# EAGLE design Retro Audio Rev2.1 (EAGLE 7.7.0)
Assembly variants: Standard
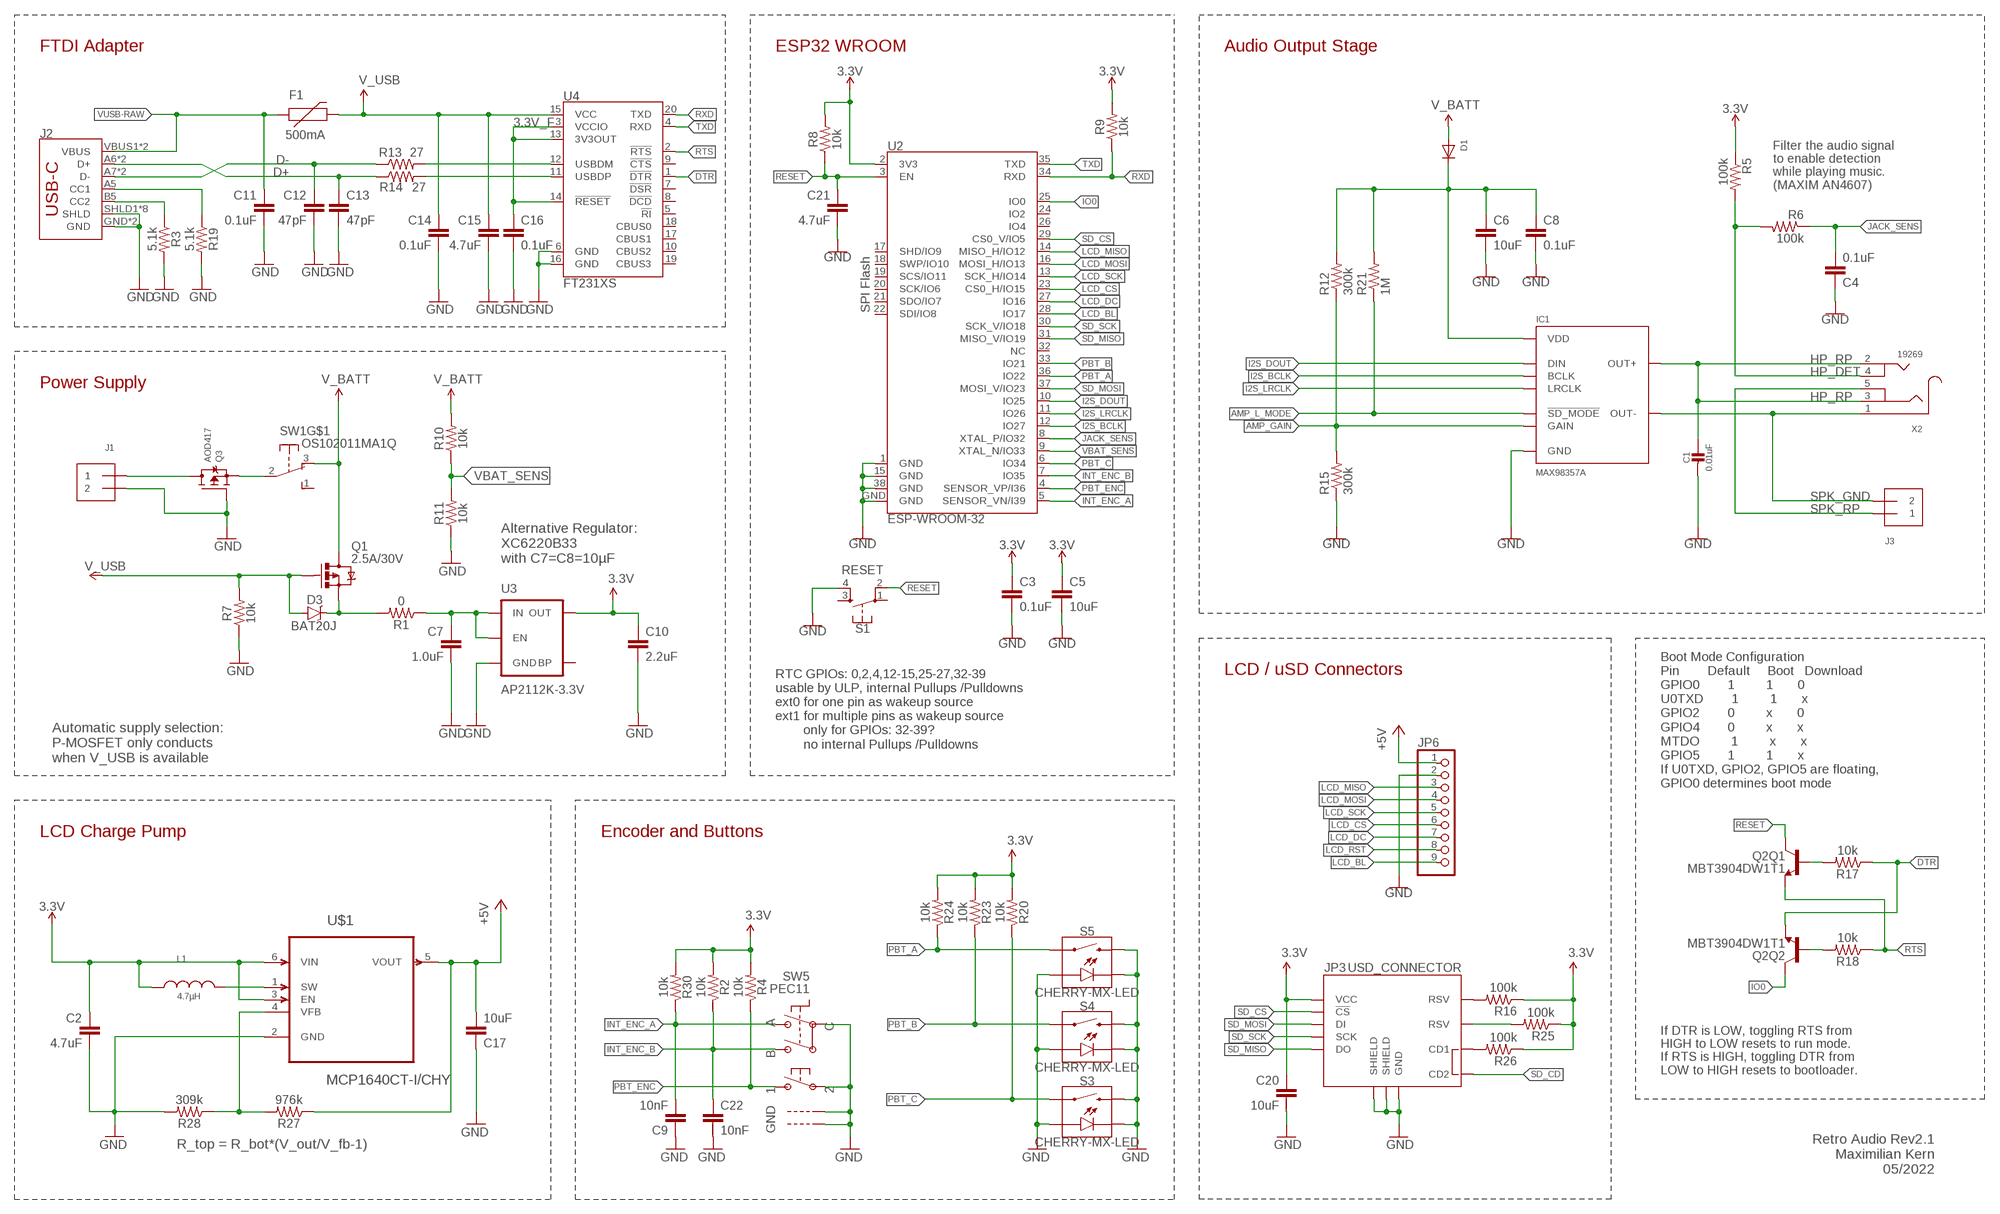
[diagram p0: schematic, sheet 1]

## Parts
C1  0.01uF  CAP_CERAMIC0603_NO  [0603-NO]  (not fitted in variant Standard)
C2  4.7uF  4.7UF-6.3V-10%(0603)0603  [0603-CAP]
C3  0.1uF  0.1UF-0603-25V-(+80/-20%)  [0603]
C4  0.1uF  0.1UF-0603-25V-(+80/-20%)  [0603]
C5  10uF  10UF-0603-6.3V-20%  [0603]
C6  10uF  10UF-0603-6.3V-20%  [0603]
C7  1.0uF  1.0UF-0805-25V-(+80/-20%)  [0805]
C8  0.1uF  0.1UF-0603-25V-(+80/-20%)  [0603]
C9  10nF  1.0UF-0805-25V-(+80/-20%)  [0805]
C10  2.2uF  1.0UF-0805-25V-(+80/-20%)  [0805]
C11  0.1uF  0.1UF-0603-25V-(+80/-20%)  [0603]
C12  47pF  47PF-0603-50V-5%  [0603]
C13  47pF  47PF-0603-50V-5%  [0603]
C14  0.1uF  0.1UF-0603-25V-(+80/-20%)  [0603]
C15  4.7uF  4.7UF-6.3V-10%(0603)0603  [0603-CAP]
C16  0.1uF  0.1UF-0603-25V-(+80/-20%)  [0603]
C17  10uF  47PF-0603-50V-5%  [0603]
C20  10uF  10UF-0603-6.3V-20%  [0603]
C21  4.7uF  4.7UF-6.3V-10%(0603)0603  [0603-CAP]
C22  10nF  1.0UF-0805-25V-(+80/-20%)  [0805]
D1  DIODE_SOD-123FL  [SOD-123FL]
D3  BAT20J  DIODE-SCHOTTKY-BAT20J  [SOD-323]
F1  500mA  PTCSMD  [PTC-1206]
IC1  MAX98357A  [TQFN-16]
J1  TERMBLOCK_1X2  [TERMBLOCK_1X2-3.5MM]
J2  USB_C16PIN  [USB-C-16P]
J3  TERMBLOCK_1X2  [TERMBLOCK_1X2-3.5MM]
JP3  USD_CONNECTOR  [MICRO-SD-SOCKET-PP]
JP6  PINHD-1X9  [1X09]
L1  4.7µH  WE-TPC_2813_744029004  [WE-TPC_2811/2813_OLD]
Q1  2.5A/30V  MOSFET-PCHANNELDMG2307L  [SOT23-3]
Q2  MBT3904DW1T1  [SC70-6]
Q3  AOD417  MOSFET-PTO252  [TO252]
R1  0  10KOHM-0603-1/10W-1%  [0603]
R2  10k  10KOHM-0603-1/10W-1%  [0603]
R3  5.1k  10KOHM-0603-1/10W-1%  [0603]
R4  10k  10KOHM-0603-1/10W-1%  [0603]
R5  100k  R-US_R0603  [R0603]
R6  100k  R-US_R0603  [R0603]
R7  10k  10KOHM-0603-1/10W-1%  [0603]
R8  10k  10KOHM-0603-1/10W-1%  [0603]
R9  10k  10KOHM-0603-1/10W-1%  [0603]
R10  10k  10KOHM-0603-1/10W-1%  [0603]
R11  10k  10KOHM-0603-1/10W-1%  [0603]
R12  300k  R-US_R0603  [R0603]  (not fitted in variant Standard)
R13  27  27OHM1/10W1%(0603)0603-RES  [0603]
R14  27  27OHM1/10W1%(0603)0603-RES  [0603]
R15  300k  R-US_R0603  [R0603]  (not fitted in variant Standard)
R16  100k  R-US_R0603  [R0603]
R17  10k  10KOHM-0603-1/10W-1%  [0603]
R18  10k  10KOHM-0603-1/10W-1%  [0603]
R19  5.1k  10KOHM-0603-1/10W-1%  [0603]
R20  10k  10KOHM-0603-1/10W-1%  [0603]
R21  1M  R-US_R0603  [R0603]
R23  10k  10KOHM-0603-1/10W-1%  [0603]
R24  10k  10KOHM-0603-1/10W-1%  [0603]
R25  100k  R-US_R0603  [R0603]
R26  100k  R-US_R0603  [R0603]
R27  976k  10KOHM-0603-1/10W-1%  [0603]
R28  309k  10KOHM-0603-1/10W-1%  [0603]
R30  10k  10KOHM-0603-1/10W-1%  [0603]
S1  RESET  MOMENTARY-SWITCH-SPST-2-SMD-4.6X2.8MM  [TACTILE_SWITCH_SMD_4.6X2.8MM]
S3  CHERRY-MX-LED  [CHERRY-MX-LED]
S4  CHERRY-MX-LED  [CHERRY-MX-LED]
S5  CHERRY-MX-LED  [CHERRY-MX-LED]
SW1  OS102011MA1Q  [OS102011MA1Q]
SW5  PEC11  ENCODER_PLUS_SWITCH_BOURNS_PEC11  [PEC11+SWITCH]
U2  ESP-WROOM-32  [ESP-WROOM-32]
U3  AP2112K-3.3V  V_REG_LDOSMD  [SOT23-5]
U4  FT231XS  [SSOP20_L]
U$1  MCP1640CT-I/CHY  [SOT95P270X145-6N]
X2  19269  AUDIO_3.5MMJACK  [4UCONN_19269]

## Nets
3.3V: C2.1 C3.1 C5.1 C10.1 C20.1 JP3.VCC L1.1 R2.2 R4.2 R5.1 R8.2 R9.2 R16.1 R20.2 R23.2 R24.2 R25.1 R26.1 R30.2 U2.2(3V3) U3.5(OUT) U$1.3(EN) U$1.6(VIN)
3.3V_F: C16.1 U4.3(VCCIO) U4.13(3V3OUT) U4.14(!RESET)
+5V: C17.2 JP6.1 R27.1 U$1.5(VOUT)
AMP_GAIN: IC1.P$2(GAIN) R12.1 R15.2
AMP_L_MODE: IC1.P$4(!SD_MODE) R21.1
B_VFB: R27.2 R28.1 U$1.4(VFB)
D+: C13.1 J2.A6(D+) J2.B6(D+) R14.1
D-: C12.1 J2.A7(D-) J2.B7(D-) R13.1
DTR: Q2.1(Q2:E) R17.1 U4.1(!DTR)
GND: C1.2 C2.2 C3.2 C4.1 C5.2 C6.2 C7.2 C8.2 C9.1 C10.2 C11.2 C12.2 C13.2 C14.2 C15.2 C16.2 C17.1 C20.2 C21.2 C22.2 IC1.P$3(GND) IC1.P$11(GND) IC1.P$15(GND) IC1.P$EP(GND) J1.2 J2.GND J2.GND2(GND) J2.SHLD1(SHLD) J2.SHLD2(SHLD) J2.SHLD3(SHLD) J2.SHLD4(SHLD) J2.SHLD5(SHLD) J2.SHLD6(SHLD) J2.SHLD7(SHLD) J2.SHLD8(SHLD) JP3.GND JP3.GND1(SHIELD) JP3.GND3(SHIELD) JP6.2 Q3.1(G) R3.2 R7.1 R11.1 R15.1 R19.2 R28.2 S1.4 S3.A S3.K(C) S3.S2 S4.A S4.K(C) S4.S2 S5.A S5.K(C) S5.S2 SW5.P$2 SW5.P$C SW5.P$GND1 SW5.P$GND2 U2.1(GND) U2.15(GND) U2.38(GND) U2.GND U3.2(GND) U4.6(GND) U4.16(GND) U$1.2(GND)
HP_DET: R5.2 R6.2 X2.4
HP_RP: C1.1 IC1.P$9(OUT+) X2.2 X2.3
I2S_BCLK: IC1.P$16(BCLK) U2.12(IO27)
I2S_DOUT: IC1.P$1(DIN) U2.10(IO25)
I2S_LRCLK: IC1.P$14(LRCLK) U2.11(IO26)
INT_ENC_A: C9.2 R30.1 SW5.P$A U2.5(SENSOR_VN/I39)
INT_ENC_B: C22.1 R2.1 SW5.P$B U2.7(IO35)
IO0: Q2.6(Q2:C) U2.25(IO0)
JACK_SENS: C4.2 R6.1 U2.8(XTAL_P/IO32)
LCD_BL: JP6.9 U2.28(IO17)
LCD_CS: JP6.6 U2.23(CS0_H/IO15)
LCD_DC: JP6.7 U2.27(IO16)
LCD_MISO: JP6.3 U2.14(MISO_H/IO12)
LCD_MOSI: JP6.4 U2.16(MOSI_H/IO13)
LCD_RST: JP6.8
LCD_SCK: JP6.5 U2.13(SCK_H/IO14)
N$2: J1.1 Q3.3(D)
N$3: C7.1 R1.1 U3.1(IN) U3.3(EN)
N$4: Q3.2(S) SW1.2(P)
N$5: D3.C Q1.2(S) R1.2
N$6: JP3.RSV1(RSV) R16.2
N$7: R13.2 U4.12(USBDM)
N$8: R14.2 U4.11(USBDP)
N$9: J2.A5(CC1) R19.1
N$10: Q2.5(Q1:B) R17.2
N$11: J2.B5(CC2) R3.1
N$12: Q2.2(Q2:B) R18.2
N$15: JP3.RSV2(RSV) R25.2
N$16: JP3.CD1 R26.2
N$17: L1.2 U$1.1(SW)
N$19: C6.1 C8.1 D1.C IC1.P$7(VDD) IC1.P$8(VDD) R12.2 R21.2
PBT_A: R24.1 S5.S1 U2.36(IO22)
PBT_B: R23.1 S4.S1 U2.33(IO21)
PBT_C: R20.1 S3.S1 U2.6(IO34)
PBT_ENC: R4.1 SW5.P$1 U2.4(SENSOR_VP/I36)
RESET: C21.1 Q2.3(Q1:C) R8.1 S1.2 U2.3(EN)
RTS: Q2.4(Q1:E) R18.1 U4.2(!RTS)
RXD: R9.1 U2.34(RXD) U4.20(TXD)
SD_CD: JP3.CD2
SD_CS: JP3.CS(!CS) U2.29(CS0_V/IO5)
SD_MISO: JP3.DO U2.31(MISO_V/IO19)
SD_MOSI: JP3.DI U2.37(MOSI_V/IO23)
SD_SCK: JP3.SCLK(SCK) U2.30(SCK_V/IO18)
SPK_GND: IC1.P$10(OUT-) J3.2 X2.1
SPK_RP: J3.1 X2.5
TXD: U2.35(TXD) U4.4(RXD)
V_BATT: D1.A Q1.3(D) R10.2 SW1.3(O)
V_USB: C14.1 C15.1 D3.A F1.2 Q1.1(G) R7.2 U4.15(VCC)
VBAT_SENS: R10.1 R11.2 U2.9(XTAL_N/IO33)
VUSB-RAW: C11.1 F1.1 J2.VBUS1(VBUS) J2.VBUS2(VBUS)
Unconnected: S1.1 S1.3 SW1.1(S) SW1.MT1(MT) SW1.MT2(MT) U2.17(SHD/IO9) U2.18(SWP/IO10) U2.19(SCS/IO11) U2.20(SCK/IO6) U2.21(SDO/IO7) U2.22(SDI/IO8) U2.24(IO2) U2.26(IO4) U2.32(NC) U3.4(BP) U4.5(!RI) U4.7(!DSR) U4.8(!DCD) U4.9(!CTS) U4.10(CBUS2) U4.17(CBUS1) U4.18(CBUS0) U4.19(CBUS3)

## Notes on the sheet
- FTDI Adapter | ESP32 WROOM | Audio Output Stage
- Filter the audio signal
  to enable detection
  while playing music.
  (MAXIM AN4607)
- SPI Flash
- Power Supply
- Alternative Regulator: 
  XC6220B33
  with C7=C8=10µF
- LCD / uSD Connectors
- Automatic supply selection:
  P-MOSFET only conducts
  when V_USB is available
- RTC GPIOs: 0,2,4,12-15,25-27,32-39
  usable by ULP, internal Pullups /Pulldowns
  ext0 for one pin as wakeup source
  ext1 for multiple pins as wakeup source
          only for GPIOs: 32-39?
          no internal Pullups /Pulldowns
- Boot Mode Configuration
  Pin        Default     Boot   Download
  GPIO0        1         1       0
  U0TXD        1         1       x
  GPIO2        0         x       0
  GPIO4        0         x       x
  MTDO         1         x       x
  GPIO5        1         1       x
  If U0TXD, GPIO2, GPIO5 are floating, 
  GPIO0 determines boot mode
- LCD Charge Pump | Encoder and Buttons
- If DTR is LOW, toggling RTS from 
  HIGH to LOW resets to run mode.
  If RTS is HIGH, toggling DTR from 
  LOW to HIGH resets to bootloader.
- R_top = R_bot*(V_out/V_fb-1)
- Retro Audio Rev2.1
  Maximilian Kern
  05/2022

## Library data of the parts
C1 = microbuilder:CAP_CERAMIC: Ceramic Capacitors For new designs, use the packages preceded by an '_' character since they are more reliable: The following footprints should be used on most boards: _0402 - Standard footprint for regular board layouts _0603 - Standard footprint for regular board layouts _0805 - Standard footprint for regular board layouts _1206 - Standard footprint for regular board layouts For extremely tight-pitch boards where space is at a premium, the following 'micro-pitch' footprints can be used (smaller pads, no silkscreen outline, etc.): _0402MP - Micro-pitch footprint for very dense/compact boards _0603MP - Micro-pitch footprint for very dense/compact boards _0805MP - Micro-pitch footprint for very dense/compact boards _1206MP - Micro-pitch footprint for very dense/compact boards
C2 C15 C21 = SparkFun-Capacitors:4.7UF-6.3V-10%(0603): CAP-08280; PROD_ID: CAP-08280
C3 C4 C8 C11 C14 C16 = SparkFun-Capacitors:0.1UF: 0.1µF ceramic capacitors A capacitor is a passive two-terminal electrical component used to store electrical energy temporarily in an electric field.; PROD_ID: CAP-00810
C5 C6 C20 = SparkFun-Capacitors:10UF: 10.0µF ceramic capacitors A capacitor is a passive two-terminal electrical component used to store electrical energy temporarily in an electric field.; PROD_ID: CAP-11015
C7 = SparkFun-Capacitors:1.0UF: 1µF ceramic capacitors A capacitor is a passive two-terminal electrical component used to store electrical energy temporarily in an electric field.; PROD_ID: CAP-11625
C9 C10 C22 = SparkFun-Capacitors:1.0UF: 1µF ceramic capacitors A capacitor is a passive two-terminal electrical component used to store electrical energy temporarily in an electric field.; PROD_ID: CAP-11625; VALUE: 1.0uF
C12 C13 = SparkFun-Capacitors:47PF: 47pF ceramic capacitors A capacitor is a passive two-terminal electrical component used to store electrical energy temporarily in an electric field.; PROD_ID: CAP-08913
C17 = SparkFun-Capacitors:47PF: 47pF ceramic capacitors A capacitor is a passive two-terminal electrical component used to store electrical energy temporarily in an electric field.; PROD_ID: CAP-08913; VALUE: 47pF
D1 = adafruit:DIODE: Diode SMADIODE - SMA Surface Mount Package 20V 1A Schottky Diode Digikey: 641-1014-6-ND DO-1N4148 - Through Hole Small Current Diode SOD-123 20V 1 A (.5mV Vf) Schottky Diode - Digikey: MBRX120TPMSCT-ND SOD-323 10V 570mA (.38mV Vf, 3ns) Schottky Diode - Digikey: ZLLS410CT-ND SOD-523 30V 30mA Schottky Diode (RB751S-40TE61) - Digikey: RB751S-40TE61CT-ND SOT23-R/W - SOT23 Package (R = Solder Paste/Reflow Ovens, W = Hand-Soldering) BAT54Film 40V 300mA - Digikey: 497-7162-1-ND
D3 = SparkFun-DiscreteSemi:DIODE-SCHOTTKY: Schottky diodes in SFE's production catalog BAT20J 1A 23V 0.62Vf RB751 120mA 40V 0.37Vf PMEG4005EJ 0.5A 40V 0.42Vf MBRA140 1A 40V 0.5Vf B340A 3A 40V SMA; PROD_ID: DIO-11623
F1 = SparkFun-PowerIC:PTC: Resettable Fuse PTC Resettable Fuse. Spark Fun Electronics SKU : COM-08357; PROD_ID: RES-11150
IC1 = SparkFun-IC-Amplifiers:MAX98357A: I2S DAC 3.2W (4-8ohm); PROD_ID: IC-14032
J1 J3 = microbuilder:TERMBLOCK_1X2: 3.5mm Terminal block http://www.ladyada.net/library/pcb/eaglelibrary.html
J2 = SparkFun-Connectors:USB_C: USB Type C 16Pin Connector Super Speed pins not available on the 16-pin purely SMD connector so this part is best for USB 2.0 implementations. D1 and D2 are tied together enabling D+/- no matter which way the cable is plugged into the connector. The two channel configuration pins (CC1/2) are exposed. These are normally connected to ground via 5.1k resistors but can be reconfigured for high current/high power applications.; PROD_ID: CONN-14122
JP3 = SparkFun-Connectors:USD_CONNECTOR: microSD Socket Push-push type µSD socket. Footprint production proven. Symbol has new and improved layout and naming accuracy. SparkFun Electronics SKU : PRT-00127. tDoc lines correctly indicate media card edge positions when inserting (unlocked, locked, depressed). NOTE: CD1 and CD2 are connected internally; PROD_ID: CONN-07820
JP6 = pinhead:PINHD-1X9: PIN HEADER
L1 = EMCComponents (rev19e):WE-TPC_2813: SMD Shielded Tiny Power Inductor Characteristics Extremely flat power inductor High current capability Magnetically shielded which results in a low leakage field Operating temperature: –40 °C to +125 °C Applications Portable power like PDA, digital camera, PCMCIA cards and displays DC/DC converter Embedded PC Mobile data gathering, telemetric <http://katalog.we-online.de/media/images/v2/WE-TPC_Gruppe_2.jpg> Details see: http://katalog.we-online.de/en/pbs/WE-TPC? Updated by Dan Xu 2014-07-11 2014 (C) Wurth Elektronik; WE-NUMBER: 744029004/4,7uH
Q1 = SparkFun-DiscreteSemi:MOSFET-PCHANNEL: Generic PMOSFET IRLML2244 - TRANS-11153 (SOT-23 -20V -4.3A) (1.Gate 2.Source 3.Drain) FQP27P06 - COM-10349 <http://www.sparkfun.com/products/10349> (TO-220 -60V -27A) (1.Gate 2.Source 3.Drain); PROD_ID: TRANS-11308
Q2 = esp32-thing-temp:MBT3904DW1T1: MBT3904DW1 Dual NPN Transistors The MBT3904W1 puts two general purpose 3904 NPN transistors in a single package. Datasheet <http://www.onsemi.com/pub_link/Collateral/MBT3904DW1T1-D.PDF>; PROD_ID: TRANS-13337
Q3 = microbuilder:MOSFET-P: P-Channel Mosfet LEGEND VDS: Voltage Drain-Source ID: Drain Current RDS(ON): Drain-Source On-State Resistance VGS(TH): Gate-Source Threshold Voltage CISS: Drain-Source Input Capacitance SOT-23 Name VDS ID RDS(ON) VGS(TH) CISS Order Number IRLML5103 30V 760mA 600 mOhm -- 75pF @ 25V Digikey: IRLML5103PBFCT-ND IRLML6401 12V 4.3A 50 mOhm 950mV @ 250µA 830pF @ 10V Digikey: IRLML6401PBFTR-ND NTR0202PL 20V 400mA 800 mOhm 2.3V @ 250uA 70pF @ 5V Digikey: NTR0202PLT1GOSTR-ND NTR4101PT1G 20V 1.8A 85 mOhm 1.2V @ 250uA 675pF @ 10V Digikey: NTR4101PT1GOSCT-ND DMP2004K 20V 600mA 900 mOhm 1V @ 250uA 175pF @ 16V Digikey: DMP2004KDICT-ND PMV65XP 20V 3.9A 76 mOhm 950mV @ 1mA 725pF @ 20V Digikey: 568-2358-2-ND TO-252 Name VDS ID RDS(ON) VGS(TH) CISS Order Number AOD417 30V 25A 34 mOhm 3V @ 250µA 920pF @ 15V Digikey: 785-1106-2-ND
R1 R3 R19 R27 R28 = SparkFun-Resistors:10KOHM: 10kΩ resistor A resistor is a passive two-terminal electrical component that implements electrical resistance as a circuit element. Resistors act to reduce current flow, and, at the same time, act to lower voltage levels within circuits. - Wikipedia; PROD_ID: RES-00824; VALUE: 10k
R2 R4 R7-R11 R17 R18 R20 R23 R24 R30 = SparkFun-Resistors:10KOHM: 10kΩ resistor A resistor is a passive two-terminal electrical component that implements electrical resistance as a circuit element. Resistors act to reduce current flow, and, at the same time, act to lower voltage levels within circuits. - Wikipedia; PROD_ID: RES-00824
R5 R6 R12 R15 R16 R21 R25 R26 = adafruit:R-US_: RESISTOR, American symbol
R13 R14 = SparkFun-Resistors:27OHM1/10W1%(0603): RES-09334; PROD_ID: RES-09334
S1 = SparkFun-Switches:MOMENTARY-SWITCH-SPST-2: Momentary Switch (Pushbutton) - SPST - Two Circuits Normally-open (NO) SPST momentary switches (buttons, pushbuttons). Schematic symbol includes two switch circuits. Variants SMD-4.6MMX2.8MM - 4.60mm x 2.80mm Tactile Momentary Button Switch - Used on SparkFun SAMD21 Mini Breakout <https://www.sparkfun.com/products/13664> SMD-5.2MM - Mini Pushbutton Switch - SMD <https://www.sparkfun.com/products/8720> - Used on Arduino Pro Mini <https://www.sparkfun.com/products/11114>; PROD_ID: SWCH-13065
S3-S5 = cherry-temp:CHERRY-MX-LED
SW1 = adafruit:OS102011MA1Q: OS10201MA1Q through-hole right angle switch http://www.ladyada.net/library/eagle
SW5 = adafruit_electromech:ENCODER_PLUS_SWITCH: Rotary Encoder with Built-In Switch PEC11 - 24 Step, PEC11-4215F-S24 - http://www.adafruit.com/products/377
U2 = SparkFun-RF:ESP-WROOM-32; PROD_ID: IC-13849
U3 = SparkFun-PowerIC:V_REG_LDO: Voltage Regulator LDO Standard 150mA LDO voltage regulator in SOT-23 layout. Micrel part MIC5205. BP (by-pass) pin is used to lower output noise with 470pF cap.; PROD_ID: VREG-12457
U4 = SparkFun-DigitalIC:FT231X: FTDI FT231X Full Speed USB to Full-handshake UART This USB2.0 Full Speed IC offers a compact bridge to full handshake UART interfaces. The device is a UART, capable of operating up to 3MBaud, with low power consumption (8mA). The FT231X includes the complete FT-X series feature set and enables USB to be added into a system design quickly and easily over a UART interface.; PROD_ID: IC-11524
U$1 = Microchip_By_element14_Batch_1:MCP1640CT-I/CHY: Synchronous Boost Regulator; MPN: MCP1640CT-I/CHY; OC_FARNELL: 1800208; OC_NEWARK: 73R3626; PACKAGE: SOT-6; SUPPLIER: Microchip
X2 = microbuilder:AUDIO_3.5MMJACK: 3.5MM Audio Jack These are normally connected as follows, from left-to right on the schematic symbol above: Tip: Left Audio Inner Ring: Right Audio Shell: Common/GND

## Board
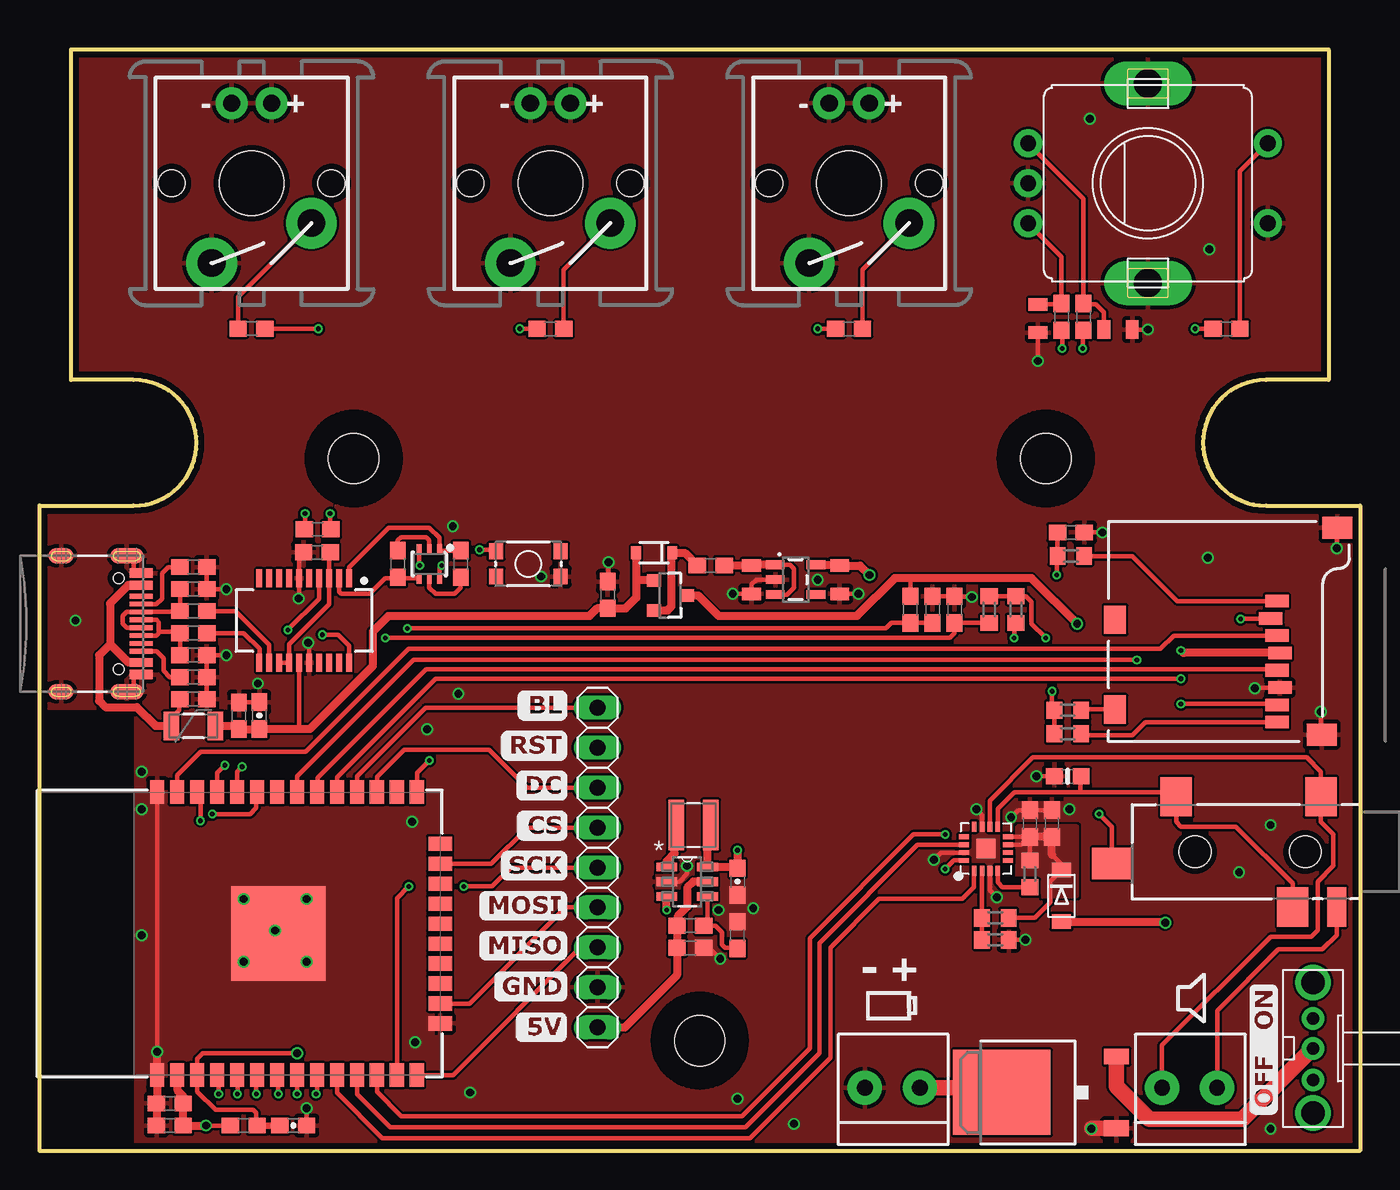
[diagram p1: board, top side]
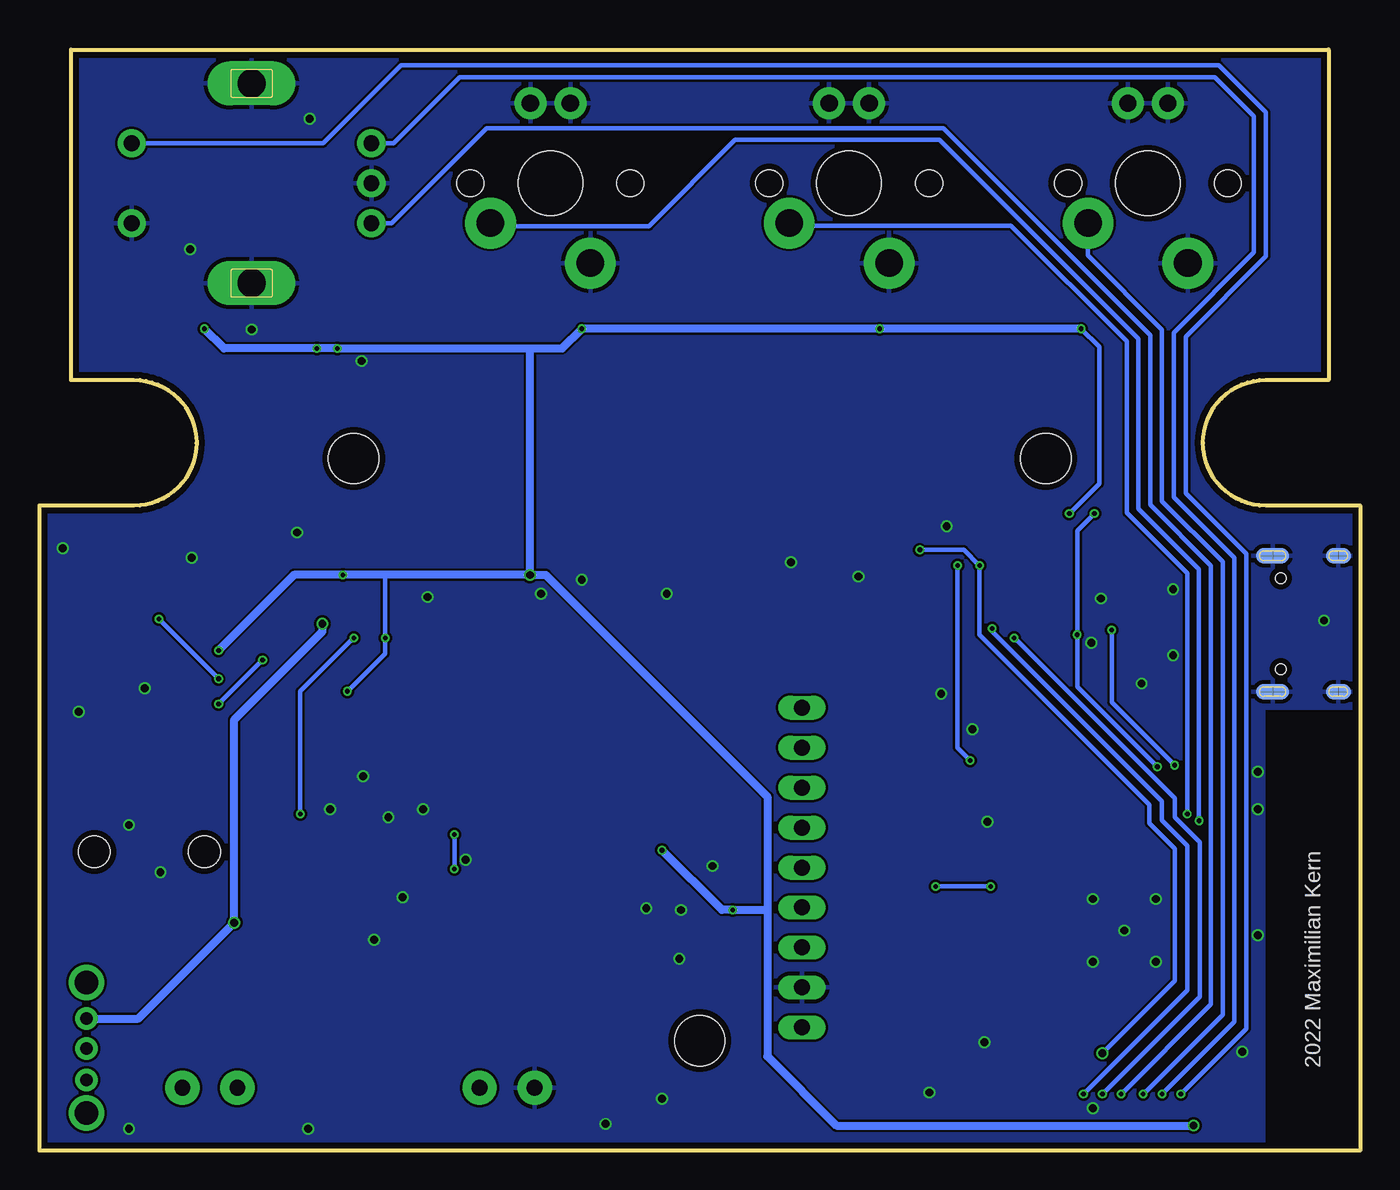
[diagram p2: board, bottom side, seen from below]

Size 84 x 70 mm. Coordinates in mm from the lower left corner, seen from the top.
Outline: 82,70 2,70 2,49 6,49 arc-180 6,41 0,41 0,0 84,0 84,41 78,41 arc-180 78,49 82,49 82,70
Copper layers (1*16): Top 0.035559375mm / dielectric 1.6mm / Bottom 0.035559375mm
Design rules "oshpark-2layer *": minimum track width 6mil, minimum drill 10mil, track to track 6mil, track to pad 6mil, pad to pad 6mil, via to via 6mil, smd to smd 6mil, copper to edge 15mil, drill to drill 6mil, minimum pad ring 5mil, minimum via ring 5mil, stop-mask expansion 2.5mil, vias tented up to drill 43mil, thermal gap 10mil
Holes 3.2 mm at 20,44 64,44 42,7
tKeepout: area 1,48 to 3,70; area 81,48 to 83,70; area 1,48 to 83,50
tRestrict: area 0,0 to 6,28
bRestrict: area 0,0 to 6,28

### Footprints (pad centres in the part's own frame; a part is rotated, then mirrored left to right if it is on the bottom)
0603-NO = smd 1.075 x 1: 1 -0.85,0; 2 0.85,0
0603-CAP = smd 1.1 x 1: 1 -0.85,0; 2 0.85,0
0603 = smd 1.1 x 1: 1 -0.85,0; 2 0.85,0
0805 = smd 0.8 x 1.2: 1 -0.9,0; 2 0.9,0
SOD-123FL = smd 0.91 x 1.22: A 1.637,0; C -1.637,0
SOD-323 = smd 0.63 x 0.83: A 1.15,0; C -1.15,0
PTC-1206 = smd 1 x 1.8: 1 -1.4,0; 2 1.4,0
TQFN-16 = smd 0.3 x 0.65: P$1 -0.75,-1.4; P$2 -0.25,-1.4; P$3 0.25,-1.4; P$4 0.75,-1.4; P$9 0.75,1.4; P$10 0.25,1.4; P$11 -0.25,1.4; P$12 -0.75,1.4 | smd 0.65 x 0.3: P$5 1.4,-0.75; P$6 1.4,-0.25; P$7 1.4,0.25; P$8 1.4,0.75; P$13 -1.4,0.75; P$14 -1.4,0.25; P$15 -1.4,-0.25; P$16 -1.4,-0.75 | smd 1.23 x 1.23: P$EP 0,0
TERMBLOCK_1X2-3.5MM = drill 1 pad 2.184: 1 1.8,0; 2 -1.7,0
USB-C-16P = smd 0.3 x 1.45: A5 -1.25,0; A6 -0.25,0; A7 0.25,0; A8 1.25,0; B5 1.75,0; B6 0.75,0; B7 -0.75,0; B8 -1.75,0 | smd 0.6 x 1.45: GND -3.225,0; GND2 3.225,0 | smd 1 x 2.1: SHLD1 -4.32,-0.915; SHLD2 4.32,-0.915 | smd 1 x 2.1 bottom: SHLD3 -4.32,-0.915; SHLD4 4.32,-0.915 | smd 1 x 1.6: SHLD5 -4.32,-5.095; SHLD8 4.32,-5.095 | smd 1 x 1.6 bottom: SHLD6 -4.32,-5.095; SHLD7 4.32,-5.095 | smd 0.55 x 1.45: VBUS1 -2.45,0; VBUS2 2.45,0 | hole 0.65: -2.89,-1.445; 2.89,-1.445
MICRO-SD-SOCKET-PP = smd 1.8 x 1.4: CD1 -2.05,0.4; CD2 -7.75,0.4 | smd 0.8 x 1.5: CS -7.84,10.3; DI -6.74,10.7; DO -2.34,10.7; GND -3.44,10.9; RSV1 -8.94,10.7; RSV2 -1.24,10.7; SCLK -4.54,10.7; VCC -5.64,10.9 | smd 1.4 x 1.9: GND1 -13.6,14.55; GND3 -0.45,13.55
1X09 = drill 1.016 long: 1 -10.16,0; 2 -7.62,0; 3 -5.08,0; 4 -2.54,0; 5 0,0; 6 2.54,0; 7 5.08,0; 8 7.62,0; 9 10.16,0
WE-TPC_2811/2813_OLD = smd 1 x 3.2: 1 -1.1,0; 2 1.1,0
SOT23-3 = smd 0.8 x 0.9: 1 -0.95,-1; 2 0.95,-1; 3 0,1.1
SC70-6 = smd 0.3 x 0.66: 1 -0.65,-0.92; 2 0,-0.92; 3 0.65,-0.92; 4 0.65,0.92; 5 0,0.92; 6 -0.65,0.92
TO252 = smd 1 x 1.6: 1 -2.28,-4.8; 2 2.28,-4.8 | smd 5.4 x 6.2: 3 0,2.5
R0603 = smd 1 x 1.1: 1 -0.85,0; 2 0.85,0
TACTILE_SWITCH_SMD_4.6X2.8MM = smd 0.9 x 1: 1 -2.05,-0.8; 2 2.05,-0.8; 3 2.05,0.8; 4 -2.05,0.8
CHERRY-MX-LED = drill 1.092 pad 2.032: A -1.27,-5.08; K 1.27,-5.08 | drill 1.753 pad 3.226: S1 -3.81,2.54; S2 2.54,5.08 | hole 4.089: 0,0 | hole 1.707: -5.08,0; 5.08,0
OS102011MA1Q = drill 0.8 pad 1.422: 1 -2,0; 2 0,0; 3 1.9,0 | drill 1.5 pad 2.184: MT1 -4.1,0; MT2 4.2,0
PEC11+SWITCH = drill 1 pad 1.8: P$1 -2.54,7.62; P$2 2.54,7.62; P$A -2.54,-7.62; P$B 2.54,-7.62; P$C 0,-7.62 | drill 1.8 pad 2.8 long: P$GND1 -6.35,0; P$GND2 6.35,0
ESP-WROOM-32 = smd 0.9 x 1.5: 1 7.7,9; 2 6.43,9; 3 5.16,9; 4 3.89,9; 5 2.62,9; 6 1.35,9; 7 0.08,9; 8 -1.19,9; 9 -2.46,9; 10 -3.73,9; 11 -5,9; 12 -6.27,9; 13 -7.54,9; 14 -8.81,9; 25 -8.81,-9; 26 -7.54,-9; 27 -6.27,-9; 28 -5,-9; 29 -3.73,-9; 30 -2.46,-9; 31 -1.19,-9; 32 0.08,-9; 33 1.35,-9; 34 2.62,-9; 35 3.89,-9; 36 5.16,-9; 37 6.43,-9; 38 7.7,-9 | smd 1.5 x 0.9: 15 -10.3,5.715; 16 -10.3,4.445; 17 -10.3,3.175; 18 -10.3,1.905; 19 -10.3,0.635; 20 -10.3,-0.635; 21 -10.3,-1.905; 22 -10.3,-3.175; 23 -10.3,-4.445; 24 -10.3,-5.715 | smd 6 x 6: GND 0,0
SOT23-5 = smd 0.55 x 1.2: 1 -0.95,-1.3; 2 0,-1.3; 3 0.95,-1.3; 4 0.95,1.3; 5 -0.95,1.3
SSOP20_L = smd 0.381 x 1.143: 1 -2.857,-2.68; 2 -2.223,-2.68; 3 -1.587,-2.68; 4 -0.953,-2.68; 5 -0.318,-2.68; 6 0.318,-2.68; 7 0.953,-2.68; 8 1.587,-2.68; 9 2.223,-2.68; 10 2.857,-2.68; 11 2.857,2.68; 12 2.223,2.68; 13 1.587,2.68; 14 0.953,2.68; 15 0.318,2.68; 16 -0.318,2.68; 17 -0.953,2.68; 18 -1.587,2.68; 19 -2.223,2.68; 20 -2.857,2.68
SOT95P270X145-6N = smd 1.321 x 0.559: 1 -1.295,0.94; 2 -1.295,0; 3 -1.295,-0.94; 4 1.295,-0.94; 5 1.295,0; 6 1.295,0.94
4UCONN_19269 = smd 2 x 2.5: 1 2.5,-3.5; 2 11.7,-3.5; 3 4.3,3.5 | smd 2.5 x 2: 4 15.8,0.75 | smd 1.2 x 2.5: 5 1.5,3.5 | hole 2: 3.5,0; 10.5,0

### Placement (x,y rotation side)
C1  65.4,23.8 180 top  (not fitted)
C2  44.4,17.1 270 top
C3  8.3,3 180 top
C4  58.2,34.4 270 top
C5  8.3,1.6 180 top
C6  63,20.8 90 top
C7  45.3,36.3 270 top
C8  64.4,20.8 90 top
C9  68.6,52.2 180 top
C10  50.9,36.3 270 top
C11  9.8,28.7 0 top
C12  9.8,35.7 0 top
C13  9.8,31.5 0 top
C14  12.7,27.65 90 top
C15  14.01,27.66 90 top
C16  17.66,38.04 180 top
C17  41.4,12.9 180 top
C20  65.6,39.3 0 top
C21  16.15,1.6 0 top
C22  63.5,52.9 270 top
D1  65,16.2 270 top
D3  39.1,38 180 top
F1  9.8,27 0 top
IC1  60.2,19.2 0 top
J1  54.2,4 0 top
J2  6.49,33.49 270 top
J3  73.1,4 0 top
JP3  68,26 270 top
JP6  35.5,18 90 top
L1  41.6,20.7 180 top
Q1  40.1,35.3 270 top
Q2  24.8,37.3 180 top
Q3  63.7,3.7 90 top
R1  42.7,37.2 180 top
R2  65,53 270 top
R3  9.8,30.1 0 top
R4  75.5,52.25 180 top
R5  62.1,34.4 90 top
R6  60.4,34.4 90 top
R7  36.15,35.33 270 top
R8  13,1.6 180 top
R9  17.7,39.5 0 top
R10  55.4,34.4 90 top
R11  56.8,34.4 270 top
R12  60.8,14.8 0 top  (not fitted)
R13  9.8,34.3 0 top
R14  9.8,32.9 0 top
R15  60.8,13.4 180 top  (not fitted)
R16  65.6,37.8 0 top
R17  26.8,37.3 270 top
R18  22.8,37.3 90 top
R19  9.8,37.1 0 top
R20  13.5,52.25 0 top
R21  63,17.6 90 top
R23  32.5,52.25 180 top
R24  51.5,52.25 180 top
R25  65.4,26.5 0 top
R26  65.4,28 0 top
R27  41.4,14.3 0 top
R28  44.4,13.7 90 top
R30  66.4,53 270 top
S1  31.1,37.3 180 top
S3  13.5,61.5 180 top
S4  32.5,61.5 180 top
S5  51.5,61.5 180 top
SW1  81,6.5 90 top
SW5  70.5,61.5 270 top
U2  15.2,13.8 180 top
U3  48.1,36.3 270 top
U4  16.84,33.7 180 top
U$1  41.2,17.1 0 top
X2  84,19 180 top

### Tracks (layer width: path | path; a pad name or v marks a point on that pad's centre or on a via)
3.3V  (via drill 0.3, 0.5)
  Top 0.3: R25.1 R26.1 64.4,28.15 v64.4,29.2 | R4.2 v73.5,52.25 | R20.2 v17.75,52.25 | R24.2 v49.5,52.25 | R23.2 v30.55,52.25 | 9.35,1.65 9.4,1.6 | 42.49,20.5 L1.1 | R8.2 v10.6,1.6 | 50.85,37.25 C10.1 | 49.5,37.35 U3.5 | v65.05,51 65.05,52.1 R2.2 | v66.35,51 66.35,52.1 R30.2 | C20.1 R16.1 64.7,37.75 v64.7,36.6 | v18.5,40.5 18.5,39.55 R9.2 | v62,32.6 62,33.45 R5.1
  Top 0.5: JP3.VCC 72.76,31.64 v72.6,31.8 | 9.4,1.6 v10.6,1.6 | U3.5 50.85,37.25 | 42.49,20.5 U$1.6 44.31,18.04 C2.1 v44.4,19.1 | C10.1 52.2,37.2 v52.8,36.6 | U2.2 8.8,4.77 8.8,3.8 9.15,3.45 C3.1 C5.1 9.2,1.65 9.35,1.65 | v39.9,15.3 U$1.3
  Bottom 0.3: 62,36.6 v62,32.6 62,31.6 v64.4,29.2 | 52.8,50.8 53,51 | 37.8,15.3 37.7,15.2 | v17.75,52.25 16.6,51.1 16.6,42.4 v18.5,40.5
  Bottom 0.5: v17.75,52.25 v30.55,52.25 v49.5,52.25 50.75,51 53,51 v65.05,51 v66.35,51 72.25,51 v73.5,52.25 | v72.6,31.8 67.8,36.6 v64.7,36.6 62,36.6 v52.8,36.6 | v44.4,19.1 40.6,15.3 v39.9,15.3 37.8,15.3 | v52.8,36.6 51.8,36.6 37.7,22.5 37.7,15.2 37.7,6 33.3,1.6 v10.6,1.6 | v52.8,36.6 52.8,50.8
3.3V_F
  Top 0.3: U4.13 U4.14 15.9,32.2 18.43,34.73 U4.3 18.43,37.96 C16.1
+5V
  Top 0.3: 40.6,14.35 R27.1
  Top 0.5: R27.1 C17.2 40.55,11.15 37.24,7.84 JP6.1 | U$1.5 41.6,17.1 41.2,16.7 41.2,15.5 40.6,14.9 40.6,14.35
AMP_GAIN
  Top 0.3: R15.2 R12.1 IC1.P$2
AMP_L_MODE
  Top 0.3: R21.1 61.25,16.75 60.95,17.05 IC1.P$4
B_VFB
  Top 0.3: U$1.4 42.49,14.54 R27.2 43,14.3 43.4,13.9 43.4,13.1 43.6,12.9 44.35,12.9 R28.1
D+
  Top 0.3: J2.B6 7.45,32.74 7.6,32.9 7.6,33 | 7.6,33 7.6,33.6 7.46,33.74 J2.A6 | 7.6,33 8.85,33 R14.1 C13.1
D-
  Top 0.3: J2.A7 5.55,33.24 5.3,33.5 5.3,34 5.54,34.24 J2.B7 8.89,34.24 R13.1 C12.1
DTR
  Top 0.3: R17.1 25.52,38.15 Q2.1 25.45,38.95 24.8,39.6 22.2,39.6 19.7,37.1 U4.1
GND  (via drill 0.5)
  Top 0.3: C11.2 R3.2 C13.2 11.6,31.5 | C8.2 C6.2 62.25,21.65 v61.8,21.2 | U2.38 v7.5,6.3 | C14.2 13.99,28.5 C15.2 | C16.2 16.53,37.76 U4.6 16.53,35.13 v16.5,35.1 | R19.2 C12.2 11.6,35.7 | 6,30.27 6,29.25 5.57,29.25 J2.SHLD4 | J2.GND 6,36.72 6,37.81 J2.SHLD1 | 7.5,3.05 C3.2 | C21.2 v17,2.7 | 66.92,1.42 v66.9,1.4 | 44.45,16.2 C2.2 | U$1.2 40.7,17.1 41.2,17.6 v41.2,18.1 | v82.5,38.3 82.5,39.55 JP3.GND1 | v81.5,27.9 81.5,26.5 JP3.GND3 | JP3.GND 77.34,29.44 v77.3,29.4 | C20.2 v67.6,39.3 | C9.1 v70.5,52.2 | C22.2 v63.5,50.2 | v36.2,37.4 36.2,36.23 R7.1 | v44.1,35.4 C7.2 45.3,36 45.6,36.3 U3.2 | R11.1 C4.1 58.25,35.2 v59.3,35.2 | U4.16 17.16,32.24 v17.1,32.3 | IC1.P$3 60.45,16.55 v60.9,16.1 | IC1.P$11 59.95,21.35 v59.6,21.7 | v62.7,13.4 R15.1 | IC1.P$15 57.35,18.95 v56.9,18.5 | C1.2 v63.4,23.8 | C17.1 42.6,12.9 v43.3,12.2 | C10.2 v52.1,35.4
  Top 0.5: C3.2 C5.2 | v7.5,6.3 U2.1 7.5,3.05
  Top 1: Q3.1 66.92,1.42
  other vias: 13,16 17,16 17,12 13,12 15,14 6.5,24.1 6.5,21.7 49.5,36.3 23.7,20.9 23.9,6.9 65.5,21.7 43.2,15.3 31.9,36.5 13.9,29.7 11.9,35.7 11.9,31.5 26.3,39.7 6.5,13.7 45.4,15.4 27.4,3.7 48,1.7 44.4,3.3 78.3,1.4 74.4,57.3 66.8,65.6 26.65,29.05 24.65,26.8 2.3,33.7 78.3,20.7 76.3,17.7 74.3,37.7
  pour Bottom: -1,71 87,71 87,-1 -1,-1
  pour Top (no thermals): 6,22.5 6,5 25,5 25,22.5
  pour Top (rank 2, no thermals): 66.1,20.8 66.1,22.1 59.2,22.1 59.2,15.6 62.1,15.6 62.1,20.8
  pour Top (no thermals): 39.3,18.5 45.6,18.5 45.6,11.9 39.3,11.9
  pour Top (rank 3): -1,71 87,71 87,-1 -1,-1
HP_DET  (via drill 0.3)
  Top 0.3: X2.4 68.2,20.6 v67.4,21.4 | R6.2 R5.2 62.75,35.25 63.1,34.9 63.1,33.5 v64,32.6
  Bottom 0.3: v67.4,21.4 67.4,29.2 v64,32.6
HP_RP
  Top 0.3: 72.2,22.4 X2.2 | IC1.P$9 60.95,21.75 62,22.8 66.2,22.8 | 66.2,22.8 72,22.8 X2.2 | 66.2,22.8 66.2,23.75 C1.1 | X2.3 79.7,17 76.1,20.6 72.6,20.6 72.3,20.9 X2.2
I2S_BCLK  (via drill 0.3)
  Top 0.3: U2.12 21.47,3.73 23,2.2 44.7,2.2 49,6.5 49,13.5 55.6,20.1 v57.6,20.1 | IC1.P$16 58.15,18.45 v57.6,17.9
  Bottom 0.3: v57.6,17.9 v57.6,20.1
I2S_DOUT
  Top 0.3: U2.10 18.93,3.67 21.8,0.8 45.2,0.8 50.3,5.9 50.3,12.9 53.4,16 58.7,16 59.45,16.75 IC1.P$1
I2S_LRCLK
  Top 0.3: U2.11 20.2,3.6 22.3,1.5 44.9,1.5 49.6,6.2 49.6,13.2 55.85,19.45 IC1.P$14
INT_ENC_A  (via drill 0.3)
  Top 0.3: v12.6,3.6 12.6,4.78 U2.5 | SW5.P$A 66.4,60.52 R30.1 66.35,53.8 67.2,53.8 67.7,53.3 C9.2
  Bottom 0.3: v12.6,3.6 8,8.2 8,37.7 11.85,41.55 11.85,52 6.75,57.1 6.75,65.75 9.25,68.25 57.27,68.25 61.48,64.04 SW5.P$A
INT_ENC_B  (via drill 0.3)
  Top 0.3: v15.2,3.6 15.2,4.72 U2.7 | SW5.P$B 65,56.84 R2.1 64.95,53.8 C22.1
  Bottom 0.3: SW5.P$B 61.59,58.96 55.55,65 26.5,65 13.35,51.85 13.35,41.05 9.5,37.2 9.5,9.3 v15.2,3.6
IO0  (via drill 0.3)
  Top 0.3: v24.8,24.8 24.01,24.01 U2.25 24.06,22.85 24.06,22.95 | Q2.6 25.45,37.05 v25.6,37.2
  Bottom 0.3: v25.6,37.2 25.6,25.6 v24.8,24.8
JACK_SENS  (via drill 0.3)
  Top 0.3: U2.8 v16.39,3.61 v16.4,3.6 | v22,32.6 57.9,32.6 58.2,32.9 C4.2 R6.1
  Bottom 0.3: v16.4,3.6 10.2,9.8 10.2,19.6 11.8,21.2 11.8,22.4 v22,32.6
LCD_BL
  Top 0.3: JP6.9 24.56,28.16 20.2,23.8 U2.28
LCD_CS
  Top 0.3: U2.23 28.75,18.25 31.04,20.54 JP6.6
LCD_DC
  Top 0.3: U2.27 21.47,23.77 23.2,25.5 28.6,25.5 31.02,23.08 JP6.7
LCD_MISO
  Top 0.3: JP6.3 34.42,12.92 26.3,4.8 U2.14
LCD_MOSI
  Top 0.3: U2.16 27.36,9.36 33.46,15.46 JP6.4
LCD_SCK  (via drill 0.3)
  Top 0.3: U2.13 22.74,16.04 v23.5,16.8 | v27,16.8 28.8,16.8 30,18 JP6.5
  Bottom 0.3: v23.5,16.8 v27,16.8
N$2
  Top 1: J1.1 60.9,4 Q3.3
N$3
  Top 0.3: 45.35,37.25 C7.1 | U3.1 47.75,37.25 48,37 48,35.8 47.55,35.35 U3.3
  Top 0.5: U3.1 45.35,37.25 | C7.1 R1.1
N$4
  Top 1: Q3.2 68.5,4.1 70.6,2 76.5,2 SW1.2
N$5
  Top 0.5: Q1.2 39.95,34.35 40.2,34.6 40.2,37.95 D3.C 41.05,38 R1.2
N$6
  Top 0.3: JP3.RSV1 72.36,34.94 69.5,37.8 R16.2
N$7
  Top 0.3: U4.12 14.62,32.18 12.5,34.3 R13.2
N$8
  Top 0.3: R14.2 13,32.9 14,31.9 U4.11
N$9
  Top 0.3: J2.A5 7.45,34.74 7.8,35.1 7.8,36.7 8.2,37.1 R19.1
N$10
  Top 0.3: R17.2 26.8,35.8 26.4,35.4 25.2,35.4 24.8,35.8 Q2.5
N$11
  Top 0.3: J2.B5 7.46,31.75 7.9,31.3 7.9,30.5 8.3,30.1 R3.1
N$12
  Top 0.3: Q2.2 24.8,38.8 24.6,39 23,39 22.8,38.8 R18.2
N$15
  Top 0.3: JP3.RSV2 70.34,27.24 69.5,26.4 66.35,26.4 R25.2
N$16
  Top 0.3: JP3.CD1 66.3,28.05 R26.2
N$17
  Top 0.3: 40.4,20.6 L1.2
  Top 0.5: U$1.1 39.91,18.41 40.4,18.9 40.4,20.6
N$18
  cutout Top: 45,7 arc-90 42,4 arc-90 39,7 arc-90 42,10 arc-90
  cutout Top: 67,44 arc-90 64,41 arc-90 61,44 arc-90 64,47 arc-90
  cutout Top: 23,44 arc-90 20,41 arc-90 17,44 arc-90 20,47 arc-90
N$19
  Top 0.3: IC1.P$8 C6.1 R21.2 | IC1.P$7 62.45,19.45 63,20 | 64.4,18.8 65,18.2 D1.C 64.3,17.14 64.3,15.8 63.3,14.8 R12.2
  Top 0.5: C6.1 C8.1 64.4,18.8
  pour Top (no thermals): 62.3,16.3 65.9,16.3 65.9,20.5 62.3,20.5
PBT_A  (via drill 0.3)
  Top 0.3: R24.1 52.35,56 S5.S1 | v10.25,20.98 10.25,22.59 U2.36
  Bottom 0.3: v10.25,20.98 10.25,36.95 14.1,40.8 14.1,51.6 26.75,64.25 39.75,64.25 45.24,58.76 55.11,58.76 S5.S1
PBT_B  (via drill 0.3)
  Top 0.3: R23.1 33.35,56 S4.S1 | v11,21.4 13.4,21.4 13.8,21.8 13.8,22.75 U2.33
  Bottom 0.3: v11,21.4 11,36.7 14.85,40.55 14.85,51.45 22.2,58.8 36.15,58.8 S4.S1
PBT_C  (via drill 0.3)
  Top 0.3: R20.1 12.65,54.3 S3.S1 | v13.8,3.6 13.8,4.75 U2.6
  Bottom 0.3: v13.8,3.6 8.75,8.65 8.75,37.45 12.6,41.3 12.6,52.2 17.31,56.91 S3.S1
PBT_ENC  (via drill 0.3)
  Top 0.3: R4.1 76.35,62.27 SW5.P$1 | v11.4,3.6 11.4,4.71 U2.4
  Bottom 0.3: SW5.P$1 65.96,64.04 61,69 9,69 6,66 6,56.85 11.1,51.75 11.1,41.8 7.25,37.95 7.25,7.75 v11.4,3.6
RESET  (via drill 0.3, 0.5)
  Top 0.3: v16.4,6.2 10.4,6.2 10.04,5.84 U2.3 10.04,3.76 11.2,2.6 13.6,2.6 13.8,2.4 13.8,1.6 R8.1 | Q2.3 24.15,37.15 v24.2,37.2 | v28,38.2 28.95,38.2 S1.2
  Top 0.406: C21.1 R8.1 | R8.1
  Bottom 0.3: v16.4,6.2 11.8,10.8 11.8,19.2 13.4,20.8 13.4,22 24.2,32.8 v24.2,37.2 25.2,38.2 v28,38.2
RTS
  Top 0.3: Q2.4 22.87,36.38 R18.1 22.75,36.4 22,36.4 21,35.4 19.2,35.4 19.07,35.53 U4.2
RXD  (via drill 0.3)
  Top 0.3: U4.20 19.7,32.1 19,32.8 v18,32.8 | U2.34 12.58,24.08 v12.9,24.4 | v16.9,40.5 16.9,39.55 R9.1
  Bottom 0.3: v12.9,24.4 18,29.5 v18,32.8 18,39.4 v16.9,40.5
SD_CS  (via drill 0.3)
  Top 0.3: U2.29 18.93,23.73 25.2,30 v72.6,30 | v76.4,33.8 78.26,33.8 JP3.CS
  Bottom 0.3: v72.6,30 v76.4,33.8
SD_MISO  (via drill 0.3)
  Top 0.3: U2.31 16.39,23.79 23.8,31.2 v69.8,31.2 | v72.6,28.4 78.64,28.4 JP3.DO
  Bottom 0.3: v69.8,31.2 v72.6,28.4
SD_MOSI
  Top 0.3: JP3.DI 72.14,32.74 71.3,31.9 23.5,31.9 16.95,25.35 10.25,25.35 8.77,23.87 U2.37
SD_SCK
  Top 0.3: U2.30 17.7,22.84 17.7,23.7 24.6,30.6 78.64,30.6 JP3.SCLK
SPK_GND
  Top 0.3: J3.2 71.4,6.7 78.3,13.6 80.9,13.6 81.3,14 81.3,17.1 82.3,18.1 82.3,20.1 81.5,20.9 X2.1 81.5,24.1 80.6,25 63.2,25 60.45,22.25 IC1.P$10
SPK_RP
  Top 0.3: X2.5 82.5,13.7 81.6,12.8 78.8,12.8 74.9,8.9 J3.1
TXD  (via drill 0.3)
  Top 0.3: U4.4 17.8,35.1 v15.8,33.1 | U2.35 11.31,24.01 v11.8,24.5
  Bottom 0.3: v15.8,33.1 15.8,28.5 v11.8,24.5
V_BATT  (via drill 0.5)
  Top 0.3: R10.2 55.4,36.4
  Top 0.5: Q1.3 41.9,35.3 43.2,34 52,34 54.4,36.4 55.4,36.4 63.1,36.4 v66,33.5 | D1.A 71.54,14.56 v71.6,14.5
  Bottom 0.5: v66,33.5 66,33 71.6,27.4 v71.6,14.5 77.7,8.4 SW1.3
V_USB
  Top 0.3: 13.99,26.8 C15.1 | C14.1 12.7,26.9 12.6,27 | U4.15 16.53,26.94 16.4,26.82
  Top 0.5: F1.2 12.6,27 12.65,27 | C14.1 13.99,26.8 | C15.1 16.4,26.82 17.21,26.82 21.2,30.8 21.2,33 22.2,34 35,34 35.48,34.48 R7.2 37.28,34.48 37.95,35.15 37.95,36.4 | D3.A 37.95,36.4 | Q1.1 38.1,36.25 37.95,36.4
VBAT_SENS  (via drill 0.3)
  Top 0.3: U2.9 17.66,3.66 v17.6,3.6 | v23.4,33.2 53.85,33.2 54.2,33.55 R10.1 R11.2
  Bottom 0.3: v17.6,3.6 11,10.2 11,19.4 12.6,21 12.6,22.2 23.4,33 v23.4,33.2
VUSB-RAW
  Top 0.3: F1.1 8.4,27.5 8.9,28 8.9,28.65 C11.1
  Top 0.5: J2.VBUS1 5.64,35.95 4.5,34.8 4.5,32.2 | J2.VBUS2 5.66,31.05 4.5,32.2 | 4.5,32.2 3.8,31.5 3.8,28.6 4.2,28.2 6.2,28.2 7.4,27 F1.1

### Text on the board
bPlace: 2022 Maximilian Kern